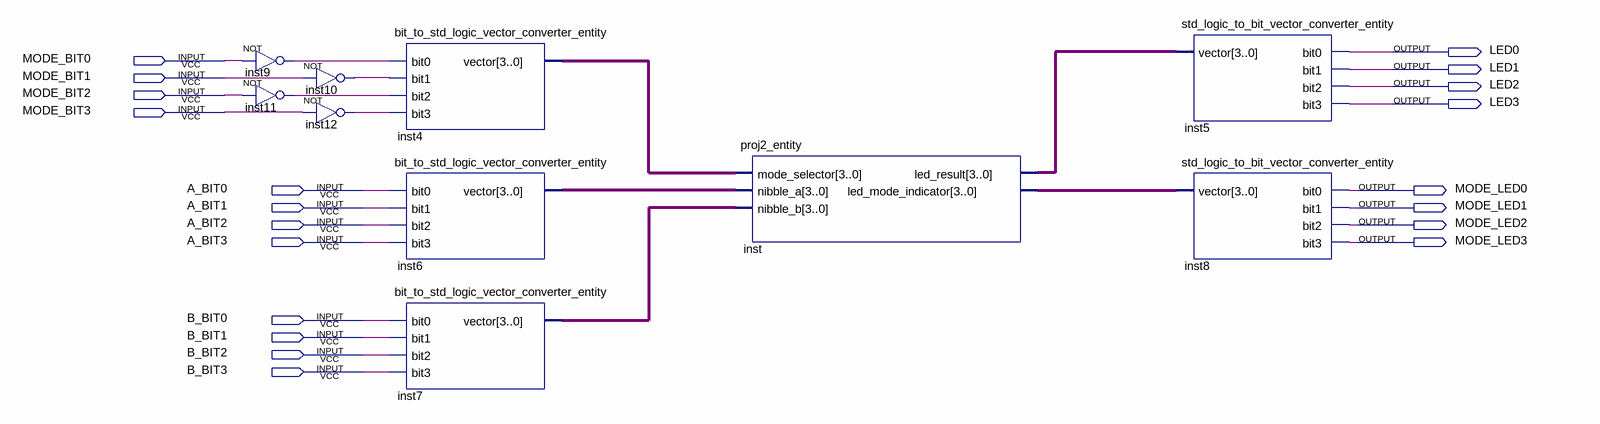
[diagram p0: schematic sheet]
// Quartus schematic project2-alu.bdf as structural Verilog: 10 symbols, 20 pins
module \project2-alu  (
  input  MODE_BIT0,
  input  MODE_BIT1,
  input  MODE_BIT2,
  input  MODE_BIT3,
  input  A_BIT0,
  input  A_BIT1,
  input  A_BIT2,
  input  A_BIT3,
  input  B_BIT0,
  input  B_BIT1,
  input  B_BIT2,
  input  B_BIT3,
  output LED0,
  output LED1,
  output LED2,
  output LED3,
  output MODE_LED0,
  output MODE_LED1,
  output MODE_LED2,
  output MODE_LED3
);

  wire inst9_out, inst10_out, inst11_out, inst12_out;
  wire [3:0] inst4_vector, inst6_vector, inst7_vector, inst_led_mode_indicator, inst_led_result;

  not inst9 (inst9_out, MODE_BIT0);
  not inst11 (inst11_out, MODE_BIT2);
  not inst10 (inst10_out, MODE_BIT1);
  not inst12 (inst12_out, MODE_BIT3);
  bit_to_std_logic_vector_converter_entity inst4 (
    .bit0(inst9_out), .bit1(inst10_out), .bit2(inst11_out), .bit3(inst12_out), .vector(inst4_vector));
  bit_to_std_logic_vector_converter_entity inst6 (
    .bit0(A_BIT0), .bit1(A_BIT1), .bit2(A_BIT2), .bit3(A_BIT3), .vector(inst6_vector));
  bit_to_std_logic_vector_converter_entity inst7 (
    .bit0(B_BIT0), .bit1(B_BIT1), .bit2(B_BIT2), .bit3(B_BIT3), .vector(inst7_vector));
  proj2_entity inst (
    .mode_selector(inst4_vector), .nibble_a(inst6_vector), .nibble_b(inst7_vector),
    .led_result(inst_led_result), .led_mode_indicator(inst_led_mode_indicator));
  std_logic_to_bit_vector_converter_entity inst5 (
    .vector(inst_led_result), .bit0(LED0), .bit1(LED1), .bit2(LED2), .bit3(LED3));
  std_logic_to_bit_vector_converter_entity inst8 (
    .vector(inst_led_mode_indicator), .bit0(MODE_LED0), .bit1(MODE_LED1), .bit2(MODE_LED2), .bit3(MODE_LED3));
endmodule
